# Altium schematic sheet PowerCircuit_24V.SchDoc
size A4
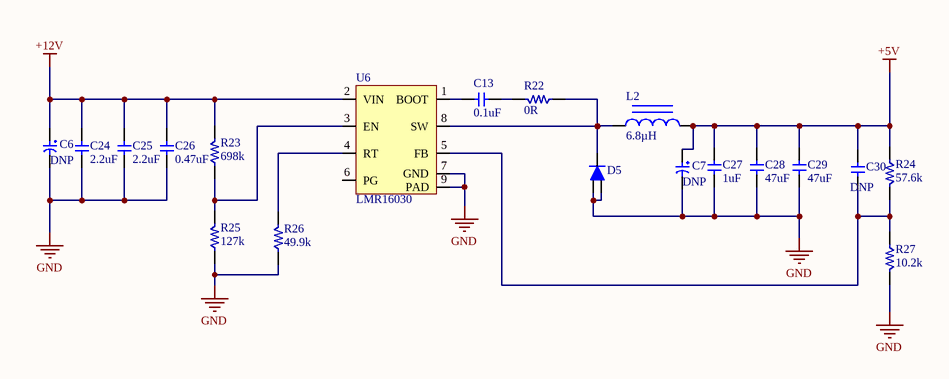
[diagram p0: PowerCircuit_24V.SchDoc]

## Parts
C6  value DNP  [Cap 6.3mm dia 5.4mm Height]  (hidden comment: 47uF, 25V)
C7  value DNP  [Cap 6.3mm dia 5.4mm Height]  (hidden comment: 47uF, 25V)
C13  value 0.1uF  [0603]  (hidden comment: Generic Capacitor)
C24  value 2.2uF  [Cap 1210]  (hidden comment: Generic Capacitor)
C25  value 2.2uF  [Cap 1210]  (hidden comment: Generic Capacitor)
C26  value 0.47uF  [0805]  (hidden comment: Generic Capacitor)
C27  value 1uF  [0805]  (hidden comment: Generic Capacitor)
C28  value 47uF  [Cap 1210]  (hidden comment: Generic Capacitor)
C29  value 47uF  [Cap 1210]  (hidden comment: Generic Capacitor)
C30  Digikey: DNP  [0603]  (hidden comment: Generic Capacitor)
D5  DIODE SCHOTTKY 60V 5A  [TO277A]  (value not drawn)
L2  Inductance: 6.8µH  [7447714068]  (hidden comment: FIXED IND 6.8UH 5.2A)
R22  value 0R  [0603]  (hidden comment: Resistor)
R23  value 698k  [0603]  (hidden comment: Resistor)
R24  value 57.6k  [0603]  (hidden comment: Resistor)
R25  value 127k  [0603]  (hidden comment: Resistor)
R26  value 49.9k  [0603]  (hidden comment: Resistor)
R27  value 10.2k  [0603]  (hidden comment: Resistor)
U6  LMR16030  [LMR16030]

## Nets
+5V: C7.1 C27.1 C28.1 C29.1 C30.1 L2.0 R24.1
+12V: C6.1 C24.1 C25.1 C26.1 R23.2 U6.2(VIN)
GND: C6.2 C7.2 C24.2 C25.2 C26.2 C27.2 C28.2 C29.2 D5.1 D5.2 R25.1 R26.1 R27.2 U6.7(GND) U6.9(PAD)
NetC13_1: C13.1 U6.1(BOOT)
NetC13_2: C13.2 R22.2
NetC30_2: C30.2 R24.2 R27.1 U6.5(FB)
NetD5_3: D5.3 L2.1 R22.1 U6.8(SW)
NetR23_1: R23.1 R25.2 U6.3(EN)
NetR26_2: R26.2 U6.4(RT)

Not connected (* = marked no-connect by the designer): U6 6(PG)

## Library data of the parts
C6 C7 = 865080443007: Polorised capacitor 47uF, 25V; Supplier: Digikey; Supplier PN: 732-8435-1-ND
C13 C24-C29 = Capacitor
  C13: Digikey: 490-1532-1-ND
  C24 C25: Digikey: 490-3385-1-ND
  C26: Digikey: 490-3326-1-ND
  C27: Digikey: 490-6484-1-ND
  C28 C29: Digikey: 490-3888-1-ND
C30 = Capacitor: Value: 27pF
D5 = SS5P6-M3/86A: DIODE SCHOTTKY 60V 5A TO277A; Manufacturer: Vishay Semiconductor Diodes Division; Voltage - Forward (Vf) (Max) @ If: 690mV @ 5A; Speed: Fast Recovery =< 500ns, > 200mA (Io); Current - Reverse Leakage @ Vr: 150µA @ 60V; Capacitance @ Vr, F: 200pF @ 4V, 1MHz; Supplier 1: Digi-Key; Manufacturer Part Number: SS5P6-M3/86A; Pricing 1: 1=0.92, 10=0.795, 25=0.7424, 100=0.5937, 250=0.55132, 500=0.4665 (CAD); Packaging: Cut Tape (CT); Part Status: Active; Diode Type: Schottky; Voltage - DC Reverse (Vr) (Max): 60V; Current - Average Rectified (Io): 5A; Reverse Recovery Time (trr): -; Mounting Type: Surface Mount; Package / Case: TO-277, 3-PowerDFN; Supplier Device Package: TO-277A (SMPC); Operating Temperature - Junction: -55°C ~ 150°C; ComponentLink1URL: http://www.vishay.com/docs/88988/ss5p6.pdf; ComponentLink1Description: http://www.vishay.com/docs/88988/ss5p6.pdf; Supplier Part Number 1: SS5P6-M3/86AGICT-ND
L2 = 7447714068: FIXED IND 6.8UH 5.2A 22 MOHM SMD; Manufacturer: Wurth Electronics Inc.; Type: Wirewound; Material - Core: Ferrite; Tolerance: ±30%; Current - Saturation: 5.8A; Shielding: Shielded; DC Resistance (DCR): 22 mOhm Max; Frequency - Self Resonant: 23.5MHz; Frequency - Test: 100kHz; Supplier 1: Digi-Key; Manufacturer Part Number: 7447714068; Pricing 1: 1=4.17, 10=3.651, 50=3.3904, 100=3.26, 250=3.12952 (CAD); Packaging: Cut Tape (CT); Part Status: Active; Current Rating: 5.2A; Q @ Freq: -; Ratings: -; Operating Temperature: -40°C ~ 125°C; Mounting Type: Surface Mount; Package / Case: Nonstandard; Supplier Device Package: -; Size / Dimension: 0.394" L x 0.394" W (10.00mm x 10.00mm); Height - Seated (Max): 0.197" (5.00mm); ComponentLink1URL: http://katalog.we-online.de/pbs/datasheet/7447714068.pdf; ComponentLink1Description: http://katalog.we-online.de/pbs/datasheet/7447714068.pdf; Supplier Part Number 1: 732-4108-1-ND
R22-R27 = Resistor: Generic Resistor
  R22: Digikey: 541-49.9HCT-ND
  R23: Digikey: 541-698KHCT-ND
  R24: Digikey: 541-57.6KHCT-ND
  R25: Digikey: 541-127KHCT-ND
  R26: Digikey: 541-49.9KHCT-ND
  R27: Digikey: 541-10.2KHCT-ND
U6 = LMR16030: IC REG BUCK ADJ 3A 8SOPWRPD; Manufacturer: Texas Instruments; Manufacturer Part Number: LMR16030PDDA; Function: Step-Down; Output Configuration: Positive; Output Type: Adjustable; Number of Outputs: 1; Voltage - Input (Min): 4.3V; Voltage - Input (Max): 60V; Voltage - Output (Min/Fixed): 0.8V; Voltage - Output (Max): 50V; Frequency - Switching: 200kHz ~ 2.5MHz; Synchronous Rectifier: No; Supplier 1: Digi-Key; Pricing 1: 1=8.44, 10=7.577, 100=6.2087, 500=5.28538, 1000=4.45755 (CAD); Packaging: Tube; Part Status: Active; Topology: Buck; Current - Output: 3A; Operating Temperature: -40°C ~ 125°C (TJ); Mounting Type: Surface Mount; Package / Case: 8-PowerSOIC (0.154", 3.90mm Width); Supplier Device Package: 8-SO PowerPad; ComponentLink1URL: http://www.ti.com/lit/ds/symlink/lmr16030.pdf; ComponentLink1Description: http://www.ti.com/lit/ds/symlink/lmr16030.pdf; Supplier Part Number 1: 296-44513-5-ND